# Altium schematic sheet root.SchDoc
size A4; SheetNumber: 1; SheetTotal: 7
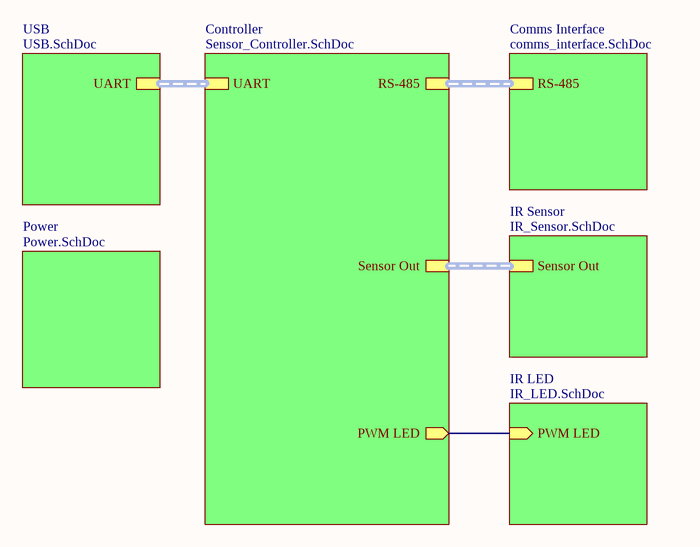
[diagram p0: root.SchDoc]

## Sub-sheets
Comms Interface = comms_interface.SchDoc: RS-485
Controller = Sensor_Controller.SchDoc: RS-485, Sensor Out, UART, PWM LED (out)
IR LED = IR_LED.SchDoc: PWM LED (in)
IR Sensor = IR_Sensor.SchDoc: Sensor Out
Power = Power.SchDoc: no entries
USB = USB.SchDoc: UART

## Nets
(unnamed): sheet Controller/PWM LED, sheet IR LED/PWM LED

## Buses and harness runs
harness sheet Comms Interface/RS-485 = sheet Controller/RS-485
harness sheet Controller/Sensor Out = sheet IR Sensor/Sensor Out
harness sheet Controller/UART = sheet USB/UART